# EAGLE schematic Schematico prototipo (EAGLE 8.5.2)
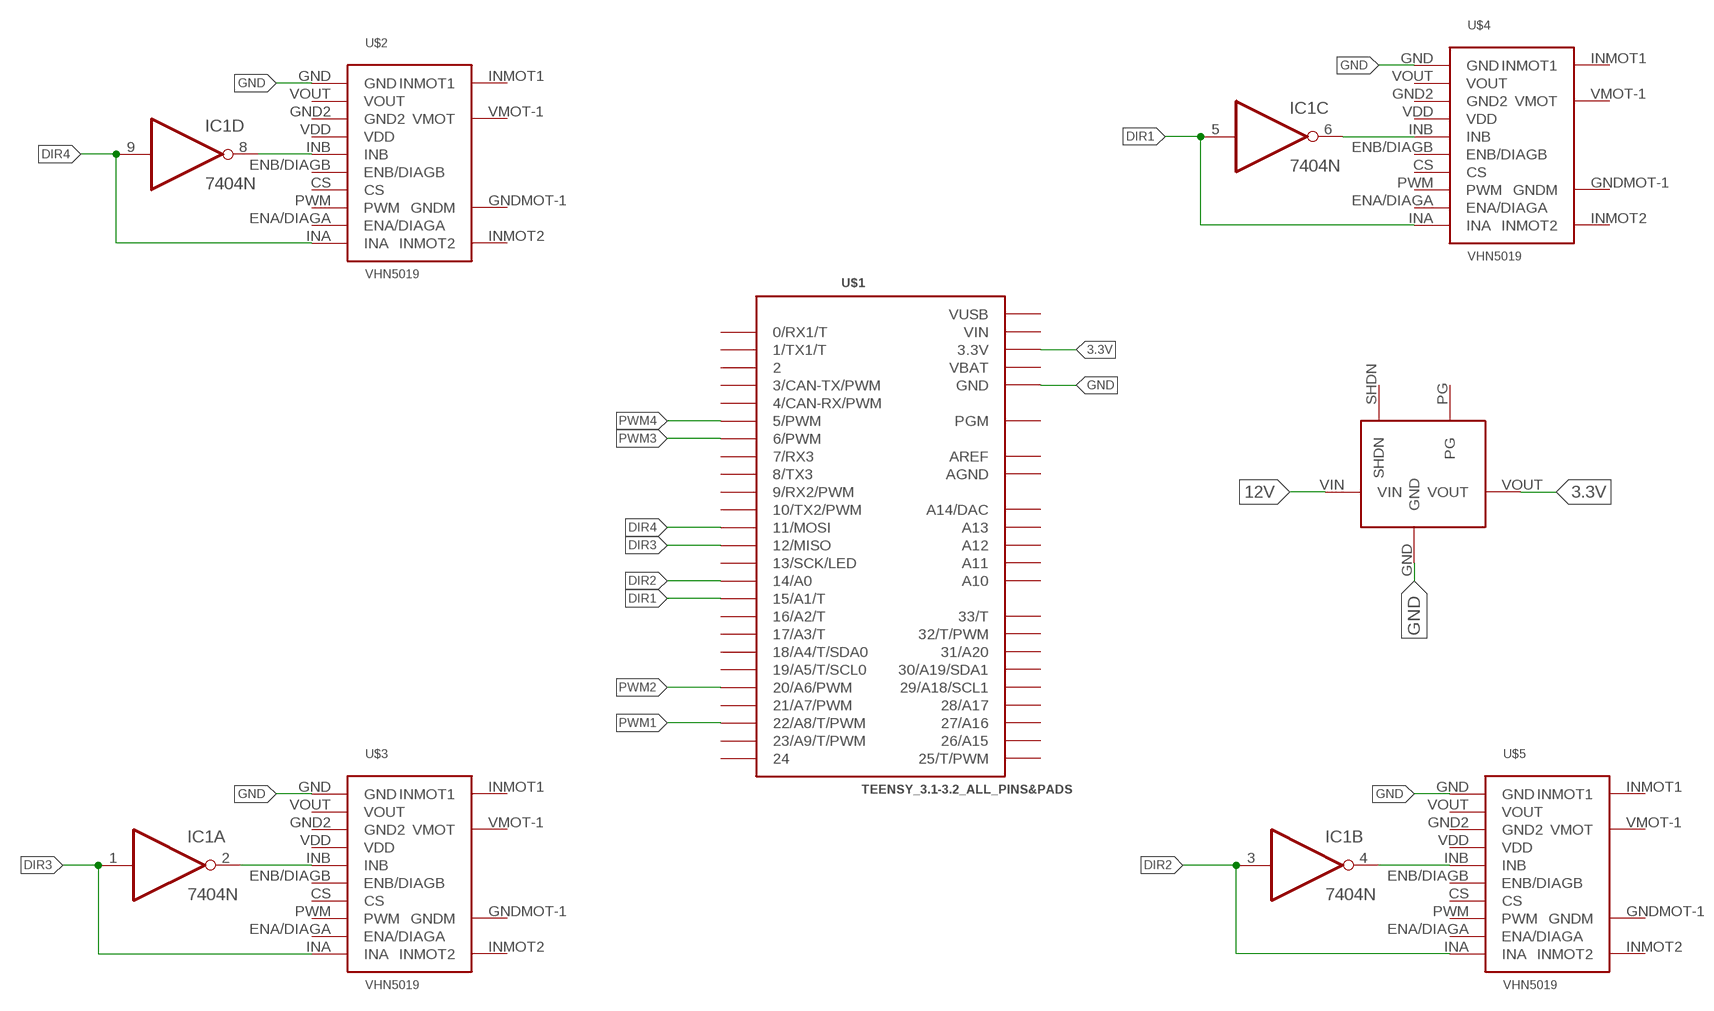
[diagram p0: schematic, sheet 1]

## Parts
IC1  7404N  [DIL14]
U$1  TEENSY_3.1-3.2_ALL_PINS&PADS  [TEENSY_3.0-3.2_ALL_PINS_&_PADS]
U$2  VHN5019  [MOTOR-SHIELD]
U$3  VHN5019  [MOTOR-SHIELD]
U$4  VHN5019  [MOTOR-SHIELD]
U$5  VHN5019  [MOTOR-SHIELD]
U$6  REGOLATORE-3.3V-1A  [REGOLATORE-3.3V-1A]

## Nets
3.3V: U$1.3.3V U$1.3.3V1(3.3V) U$1.3.3V2(3.3V) U$6.VOUT
12V: U$6.VIN
DIR1: IC1.5(C:I) U$1.15/A1(15/A1/T) U$4.INA
DIR2: IC1.3(B:I) U$1.14/A0 U$5.INA
DIR3: IC1.1(A:I) U$1.12(12/MISO) U$3.INA
DIR4: IC1.9(D:I) U$1.11(11/MOSI) U$2.INA
GND: U$1.GND U$1.GND1(GND) U$1.GND2(GND) U$2.GND U$3.GND U$4.GND U$5.GND U$6.GND
N$1: IC1.2(A:O) U$3.INB
N$3: IC1.4(B:O) U$5.INB
N$5: IC1.8(D:O) U$2.INB
N$7: IC1.6(C:O) U$4.INB
PWM1: U$1.22/A8(22/A8/T/PWM)
PWM2: U$1.20/A6(20/A6/PWM)
PWM3: U$1.6(6/PWM)
PWM4: U$1.5(5/PWM)
Unconnected: IC1.10(E:O) IC1.11(E:I) IC1.12(F:O) IC1.13(F:I) U$1.0(0/RX1/T) U$1.1(1/TX1/T) U$1.2 U$1.3(3/CAN-TX/PWM) U$1.4(4/CAN-RX/PWM) U$1.7(7/RX3) U$1.8(8/TX3) U$1.9(9/RX2/PWM) U$1.10(10/TX2/PWM) U$1.13(13/SCK/LED) U$1.16/A2(16/A2/T) U$1.17/A3(17/A3/T) U$1.18/A4(18/A4/T/SDA0) U$1.19/A5(19/A5/T/SCL0) U$1.21/A7(21/A7/PWM) U$1.23/A9(23/A9/T/PWM) U$1.24 U$1.25(25/T/PWM) U$1.26(26/A15) U$1.27(27/A16) U$1.28(28/A17) U$1.29(29/A18/SCL1) U$1.30(30/A19/SDA1) U$1.31(31/A20) U$1.32(32/T/PWM) U$1.33(33/T) U$1.A10 U$1.A11 U$1.A12 U$1.A13 U$1.PGM U$1.RESET/DAC(A14/DAC) U$2.CS U$2.ENA/DIAGA U$2.ENB/DIAGB U$2.GND2 U$2.GNDMOT-1(GNDM) U$2.INMOT1 U$2.INMOT2 U$2.PWM U$2.VDD U$2.VMOT-1(VMOT) U$2.VOUT U$3.CS U$3.ENA/DIAGA U$3.ENB/DIAGB U$3.GND2 U$3.GNDMOT-1(GNDM) U$3.INMOT1 U$3.INMOT2 U$3.PWM U$3.VDD U$3.VMOT-1(VMOT) U$3.VOUT U$4.CS U$4.ENA/DIAGA U$4.ENB/DIAGB U$4.GND2 U$4.GNDMOT-1(GNDM) U$4.INMOT1 U$4.INMOT2 U$4.PWM U$4.VDD U$4.VMOT-1(VMOT) U$4.VOUT U$5.CS U$5.ENA/DIAGA U$5.ENB/DIAGB U$5.GND2 U$5.GNDMOT-1(GNDM) U$5.INMOT1 U$5.INMOT2 U$5.PWM U$5.VDD U$5.VMOT-1(VMOT) U$5.VOUT U$6.PG U$6.SHDN

## Power pins joined to a net without a drawn wire
AGND: U$1.AGND
AREF: U$1.AREF
GND: IC1.7(P:GND)
VBAT: U$1.VBAT
VCC: IC1.14(P:VCC)
VIN: U$1.VIN
VUSB: U$1.VUSB

## Library data of the parts
IC1 = 74xx-eu:74*04: Hex INVERTER
U$1 = Teensy_3_and_LC_Series_Boards_v1.4:TEENSY_3.1-3.2_ALL_PINS&PADS: Footprint for Teensy 3.1 or 3.2 board using all pads and all through-holes. Pads need a 2x7 0.1" SMD header.
U$2-U$5 = VHN5019:VHN5019: Operating voltage: 5.5 – 24 V1 Output current: 12 A continuous (30 maximum) 3V-compatible inputs PWM operation up to 20 kHz, which is ultrasonic and allows for quieter motor operation Current sense output proportional to motor current (approx. 140 mV/A) Motor indicator LEDs (indicates what the outputs are doing even when no motor is connected) Robust: Reverse-voltage protection Can survive input voltages up to 41 V Undervoltage and overvoltage shutdown High-side and low-side thermal shutdown Short-to-ground and short-to-Vcc protection; MOTOR: motor
U$6 = libreria valerio:REGOLATORE-3.3V-1A: regolatore di tensione da 12V a 3,3 V